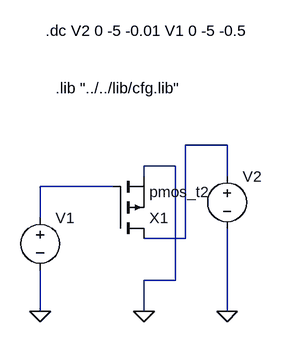
[diagram p0: schematic pmos.asc]
pmos.asc, the LTspice schematic file:
Version 4
SHEET 1 880 680
WIRE 464 32 400 32
WIRE 384 64 336 64
WIRE 336 80 336 64
WIRE 464 80 464 32
WIRE 288 96 176 96
WIRE 176 144 176 96
WIRE 400 176 400 32
WIRE 400 176 336 176
WIRE 384 240 384 64
WIRE 384 240 336 240
WIRE 176 288 176 224
WIRE 336 288 336 240
WIRE 464 288 464 160
FLAG 336 288 0
FLAG 464 288 0
FLAG 176 288 0
SYMBOL pmos 288 176 M180
SYMATTR InstName X1
SYMATTR Value pmos_t2
SYMATTR Prefix X
SYMBOL voltage 176 128 R0
SYMATTR InstName V1
SYMATTR Value ""
SYMBOL voltage 464 64 R0
SYMATTR InstName V2
SYMATTR Value ""
TEXT 184 -144 Left 2 !.dc V2 0 -5 -0.01 V1 0 -5 -0.5
TEXT 200 -56 Left 2 !.lib "../../lib/cfg.lib"

The netlist it stands for:
* pmos.asc
XX1 N001 N002 0 pmos_t2  ; pins D G S
V1 N002 0
V2 N001 0
.dc V2 0 -5 -0.01 V1 0 -5 -0.5
.lib "../../lib/cfg.lib"
.backanno
.end